# EAGLE schematic balloon-v02-matt (EAGLE 7.6.0)
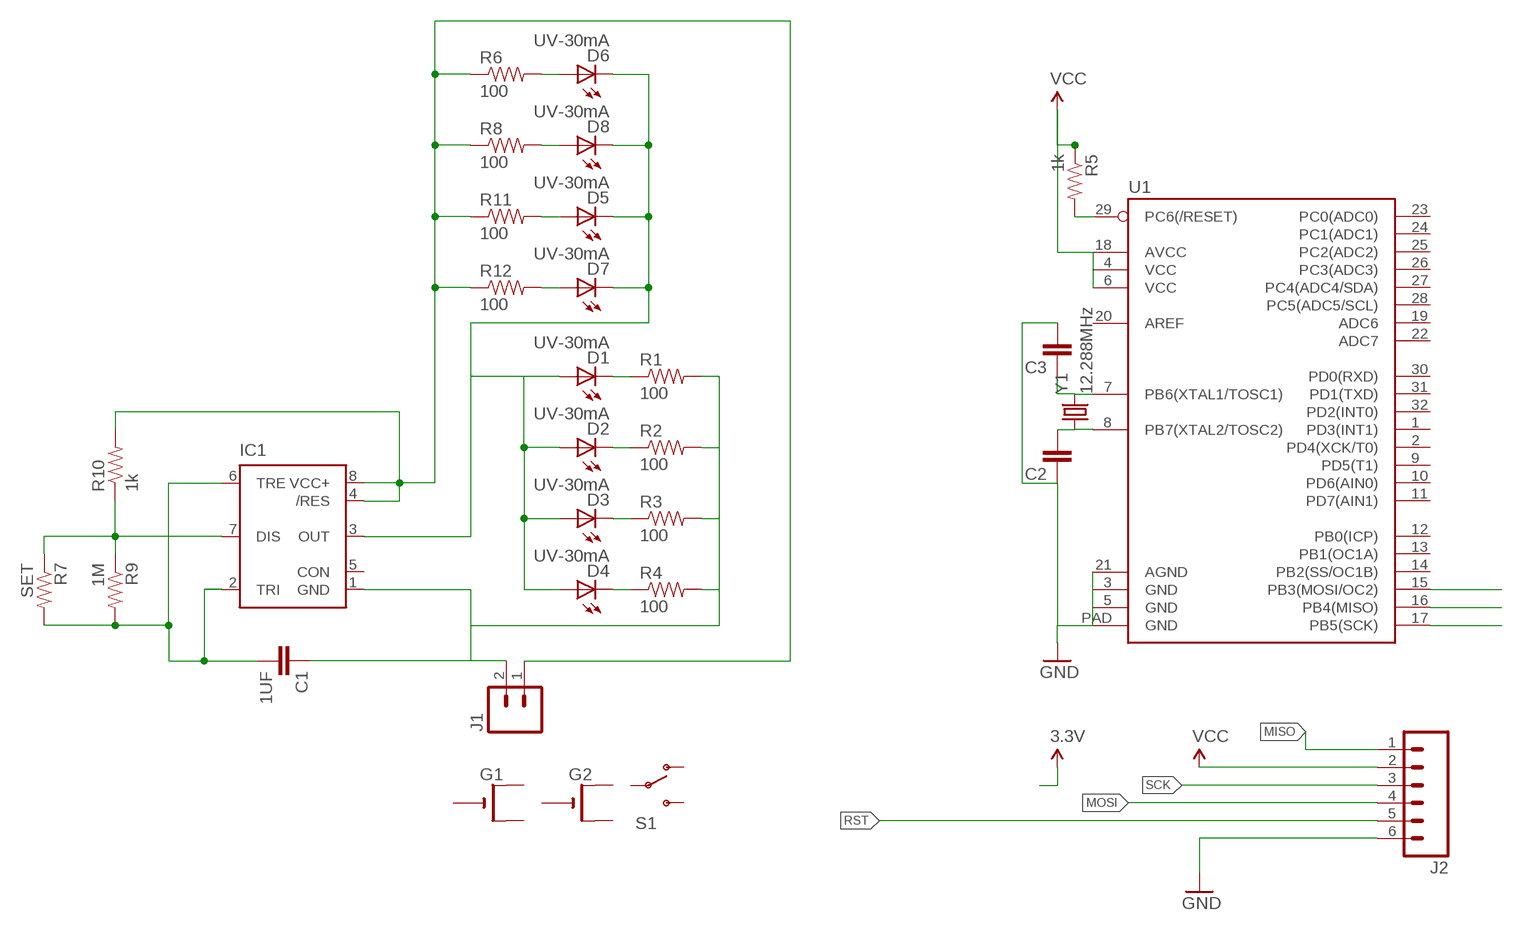
[diagram p0: schematic, sheet 1]

## Parts
C1  1UF  CAP0603-CAP  [0603-CAP]
C2  CAP0603-CAP  [0603-CAP]
C3  CAP0603-CAP  [0603-CAP]
D1  UV-30mA  LEDCHIPLED_0603  [CHIPLED_0603]
D2  UV-30mA  LEDCHIPLED_0603  [CHIPLED_0603]
D3  UV-30mA  LEDCHIPLED_0603  [CHIPLED_0603]
D4  UV-30mA  LEDCHIPLED_0603  [CHIPLED_0603]
D5  UV-30mA  LEDCHIPLED_0603  [CHIPLED_0603]
D6  UV-30mA  LEDCHIPLED_0603  [CHIPLED_0603]
D7  UV-30mA  LEDCHIPLED_0603  [CHIPLED_0603]
D8  UV-30mA  LEDCHIPLED_0603  [CHIPLED_0603]
G1  CR2032SMT  [CR2032-SMD]
G2  CR2032SMT  [CR2032-SMD]
IC1  NE555D  [SO08]
J1  M02PTH3  [1X02_LONGPADS]
J2  M06SIP_LOCK  [1X06-SIP_LOCK]
R1  100  RESISTOR0603-RES  [0603-RES]
R2  100  RESISTOR0603-RES  [0603-RES]
R3  100  RESISTOR0603-RES  [0603-RES]
R4  100  RESISTOR0603-RES  [0603-RES]
R5  1k  RESISTOR0603-RES  [0603-RES]
R6  100  RESISTOR0603-RES  [0603-RES]
R7  SET  RESISTORKIT  [AXIAL-0.3-KIT]
R8  100  RESISTOR0603-RES  [0603-RES]
R9  1M  RESISTOR0603-RES  [0603-RES]
R10  1k  RESISTOR0603-RES  [0603-RES]
R11  100  RESISTOR0603-RES  [0603-RES]
R12  100  RESISTOR0603-RES  [0603-RES]
S1  SWITCH-SPDT-SMD-A  [SWITCH-SPST-SMD-A]
U1  ATMEGA328P_MLFMLF32  [MLF32-PAD]
Y1  12.288MHz  CRYSTALCRYSTAL-SMD-5X3-12.288MHZ  [CRYSTAL-SMD-5X3]

## Nets
DISCHARGE: IC1.7(DIS) R7.P$1 R9.1 R10.1
GND: C1.1 C2.1 C3.2 IC1.1(GND) J1.2 J2.6 R1.2 R2.2 R3.2 R4.2 U1.3(GND) U1.5(GND) U1.21(AGND) U1.PAD(GND)
MISO: J2.1 U1.16(PB4(MISO))
MOSI: J2.4 U1.15(PB3(MOSI/OC2))
N$1: D8.A R8.2
N$2: D5.A R11.2
N$3: D1.C R1.1
N$4: D7.A R12.2
N$5: D2.C R2.1
N$6: D6.A R6.2
N$7: D3.C R3.1
N$9: D4.C R4.1
N$11: C3.1 U1.7(PB6(XTAL1/TOSC1)) Y1.3
N$12: C2.2 U1.8(PB7(XTAL2/TOSC2)) Y1.1
OUT: D1.A D2.A D3.A D4.A D5.C D6.C D7.C D8.C IC1.3(OUT)
RST: J2.5 R5.2 U1.29(PC6(/RESET))
SCK: J2.3 U1.17(PB5(SCK))
THRESHOLD: C1.2 IC1.2(TRI) IC1.6(TRE) R7.P$2 R9.2
VCC: IC1.4(/RES) IC1.8(VCC+) J1.1 J2.2 R5.1 R6.1 R8.1 R10.2 R11.1 R12.1 U1.4(VCC) U1.6(VCC) U1.18(AVCC)
Unconnected: G1.+$1(+) G1.+$2(+1) G1.- G2.+$1(+) G2.+$2(+1) G2.- IC1.5(CON) S1.1(O) S1.2(P) S1.3(S) U1.1(PD3(INT1)) U1.2(PD4(XCK/T0)) U1.9(PD5(T1)) U1.10(PD6(AIN0)) U1.11(PD7(AIN1)) U1.12(PB0(ICP)) U1.13(PB1(OC1A)) U1.14(PB2(SS/OC1B)) U1.19(ADC6) U1.20(AREF) U1.22(ADC7) U1.23(PC0(ADC0)) U1.24(PC1(ADC1)) U1.25(PC2(ADC2)) U1.26(PC3(ADC3)) U1.27(PC4(ADC4/SDA)) U1.28(PC5(ADC5/SCL)) U1.30(PD0(RXD)) U1.31(PD1(TXD)) U1.32(PD2(INT0))

## Library data of the parts
C1 = SparkFun-Capacitors:CAP: Capacitor Standard 0603 ceramic capacitor, and 0.1" leaded capacitor.; DIGIKEY_PART_ID: 1276-1946-1-ND
C2 C3 = SparkFun-Passives:CAP: Capacitor Standard 0603 ceramic capacitor, and 0.1" leaded capacitor.
D1-D8 = led:LED: LED OSRAM: - CHIPLED LG R971, LG N971, LY N971, LG Q971, LY Q971, LO R971, LY R971 LH N974, LH R974 LS Q976, LO Q976, LY Q976 LO Q996 - Hyper CHIPLED LW Q18S LB Q993, LB Q99A, LB R99A - SideLED LS A670, LO A670, LY A670, LG A670, LP A670 LB A673, LV A673, LT A673, LW A673 LH A674 LY A675 LS A676, LA A676, LO A676, LY A676, LW A676 LS A679, LY A679, LG A679 - Hyper Micro SIDELED® LS Y876, LA Y876, LO Y876, LY Y876 LT Y87S - SmartLED LW L88C, LW L88S LB L89C, LB L89S, LG L890 LS L89K, LO L89K, LY L89K LS L896, LA L896, LO L896, LY L896 - TOPLED LS T670, LO T670, LY T670, LG T670, LP T670 LSG T670, LSP T670, LSY T670, LOP T670, LYG T670 LG T671, LOG T671, LSG T671 LB T673, LV T673, LT T673, LW T673 LH T674 LS T676, LA T676, LO T676, LY T676, LB T676, LH T676, LSB T676, LW T676 LB T67C, LV T67C, LT T67C, LS T67K, LO T67K, LY T67K, LW E67C LS E67B, LA E67B, LO E67B, LY E67B, LB E67C, LV E67C, LT E67C LW T67C LS T679, LY T679, LG T679 LS T770, LO T770, LY T770, LG T770, LP T770 LB T773, LV T773, LT T773, LW T773 LH T774 LS E675, LA E675, LY E675, LS T675 LS T776, LA T776, LO T776, LY T776, LB T776 LHGB T686 LT T68C, LB T68C - Hyper Mini TOPLED® LB M676 - Mini TOPLED Santana® LG M470 LS M47K, LO M47K, LY M47K Source: http://www.osram.convergy.de LUXEON: - LUMILED® LXK2-PW12-R00, LXK2-PW12-S00, LXK2-PW14-U00, LXK2-PW14-V00 LXK2-PM12-R00, LXK2-PM12-S00, LXK2-PM14-U00 LXK2-PE12-Q00, LXK2-PE12-R00, LXK2-PE12-S00, LXK2-PE14-T00, LXK2-PE14-U00 LXK2-PB12-K00, LXK2-PB12-L00, LXK2-PB12-M00, LXK2-PB14-N00, LXK2-PB14-P00, LXK2-PB14-Q00 LXK2-PR12-L00, LXK2-PR12-M00, LXK2-PR14-Q00, LXK2-PR14-R00 LXK2-PD12-Q00, LXK2-PD12-R00, LXK2-PD12-S00 LXK2-PH12-R00, LXK2-PH12-S00 LXK2-PL12-P00, LXK2-PL12-Q00, LXK2-PL12-R00 Source: www.luxeon.com KINGBRIGHT: KA-3528ASYC Source: www.kingbright.com
G1 G2 = adafruit:CR2032; DIGIKEY_PART_ID: BK-913-ND
IC1 = SparkFun-AnalogIC:NE555: General purpose bipolar Timer; DIGIKEY_PART_ID: ICM7555CBAZ-TCT-ND
J1 = SparkFun-Connectors:M02: Standard 2-pin 0.1" header. Use with - straight break away headers ( PRT-00116) - right angle break away headers (PRT-00553) - swiss pins (PRT-00743) - machine pins (PRT-00117) - female headers (PRT-00115) Molex polarized connector foot print use with: PRT-08233 with associated crimp pins and housings. 2.54_SCREWTERM for use with PRT-10571. 3.5mm Screw Terminal footprints for PRT-08084 5mm Screw Terminal footprints for use with PRT-08432
J2 = SparkFun-Connectors:M06: Header 6 Standard 6-pin 0.1" header. Use with straight break away headers (SKU : PRT-00116), right angle break away headers (PRT-00553), swiss pins (PRT-00743), machine pins (PRT-00117), and female headers (PRT-00115). Molex polarized connector foot print use with SKU : PRT-08094 with associated crimp pins and housings. NOTES ON THE VARIANTS LOCK and LOCK_LONGPADS... This footprint was designed to help hold the alignment of a through-hole component (i.e. 6-pin header) while soldering it into place. You may notice that each hole has been shifted either up or down by 0.005 of an inch from it's more standard position (which is a perfectly straight line). This slight alteration caused the pins (the squares in the middle) to touch the edges of the holes. Because they are alternating, it causes a "brace" to hold the component in place. 0.005 has proven to be the perfect amount of "off-center" position when using our standard breakaway headers. Although looks a little odd when you look at the bare footprint, once you have a header in there, the alteration is very hard to notice. Also,if you push a header all the way into place, it is covered up entirely on the bottom side. This idea of altering the position of holes to aid alignment will be further integrated into the Sparkfun Library for other footprints. It can help hold any component with 3 or more connection pins.
R1-R4 R6 R8 R11 R12 = SparkFun-Resistors:RESISTOR: Resistor Basic schematic elements and footprints for 0603, 1206, and PTH resistors.; DIGIKEY_PART_ID: P100BZCT-ND
R5 R10 = SparkFun-Resistors:RESISTOR: Resistor Basic schematic elements and footprints for 0603, 1206, and PTH resistors.; DIGIKEY_PART_ID: P1KBZCT-ND
R7 R9 = SparkFun-Resistors:RESISTOR: Resistor Basic schematic elements and footprints for 0603, 1206, and PTH resistors.; DIGIKEY_PART_ID: P1MBZCT-ND
S1 = SparkFun-Electromechanical:SWITCH-SPDT: SPDT Switch Simple slide switch, Spark Fun Electronics SKU : COM-00102 DPDT SMT slide switch, AYZ0202, SWCH-08179; DIGIKEY_PART_ID: 679-1847-1-ND; PROD_ID: SWCH-10651
U1 = SparkFun-DigitalIC:ATMEGA328P_MLF: 32-Pin Atmega328 part Commonly used on Arduino compatible boards Available in QFP and QFN packages TQFP is IC-09069 QFN is non-stock
Y1 = SparkFun-FreqCtrl:CRYSTAL: Various standard crystals. Proven footprints.; PROD_ID: XTAL-09653